# EAGLE design Hfield1A (EAGLE 6.3)
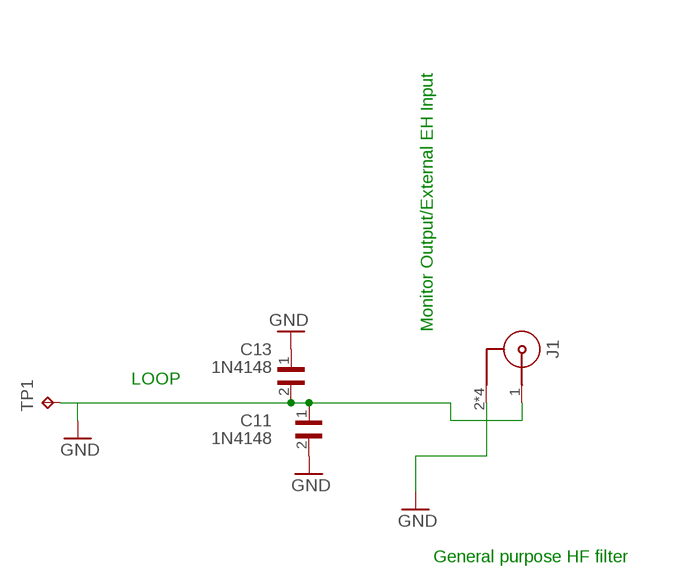
[diagram p0: schematic, sheet 1]

## Parts
C11  1N4148  WCAP-CSGP_0805-REFLOW  [WCAP-CSGP_0805_REFLOW]
C13  1N4148  WCAP-CSGP_0805-REFLOW  [WCAP-CSGP_0805_REFLOW]
J1  60312202114509  [60312202114509]
TP1  TPB2,54  [B2,54]

## Nets
GND: C11.1 C11.2 C13.1 C13.2 J1.1 J1.2 J1.3 J1.4 J1.5 TP1.TP

## Notes on the sheet
- Monitor Output/External EH Input
- LOOP
- General purpose HF filter

## Library data of the parts
C11 C13 = Eagle_Wurth_Elektronik_Passive_Capacitors_rev15a:WCAP-CSGP: WCAP-CSGP Ceramic Capacitors Characteristics Multilayer Ceramic Chip Capacitor Recommended soldering:Reflow, for 0603 and 0805 wave soldering is also allowed Operating temperature:-55 °C to +125 °C; Ceramic characteristics: Class I - NPO ; Class II -X7R, X5R High performance ceramic High capacitance stability Minimal aging Termination:Cu/Ni/Sn <http://katalog.we-online.de/media/images/eisos/WCAP-CSGP_pf2.jpg> Details see: http://katalog.we-online.de/en/pbs/WCAP-CSGP/?m Created: 2015-01-28 2015 (C) Wurth Elektronik
J1 = 60312202111527_Eagle_WR-SMA_rev19a:60312202114509: WR-SMA PCB End Launch Jack Round Post 1.6 mm MATERIAL PROPERTIES Insulator Material PTFE Insulator Color White Center Contact Material Beryllium Copper Center Contact Plating Gold, min. 0.76µm over Nickel Body Material Brass Body Plating Gold, min. 0.076µm over Nickel KIND PROPERTIES Interface MIL-STD-348 Connector Type SMA Gender Jack Orientation Type Straight GENERAL INFORMATION Operating Temperature -65 °C up to +165 °C Compliance RoHS ELECTRICAL PROPERTIES Frequency Range DC~18 GHz MECHANICAL PROPERTIES Mating Cycle 500 Cycles PACKAGING PROPERTIES Packaging Tray <https://katalog.we-online.com/media/images/v2/o122849v209%20WR-SMA_60312202114509.jpg> Details see: https://katalog.we-online.com/en/em/WR-SMA_60312202114509 Updated by Ella Wu 2019-11-07 2019(C) Würth Elektronik; DATASHEET-URL: https://katalog.we-online.com/em/datasheet/60312202114509.pdf; GENDER: Jack; INTERFACE: MIL-STD-348; MOUNT: End Launch; ORIENTATION-TYPE: Straight; PART-NUMBER: 60312202114509; Z: 50Ohm
TP1 = testpad:TP: Test pad

## Board
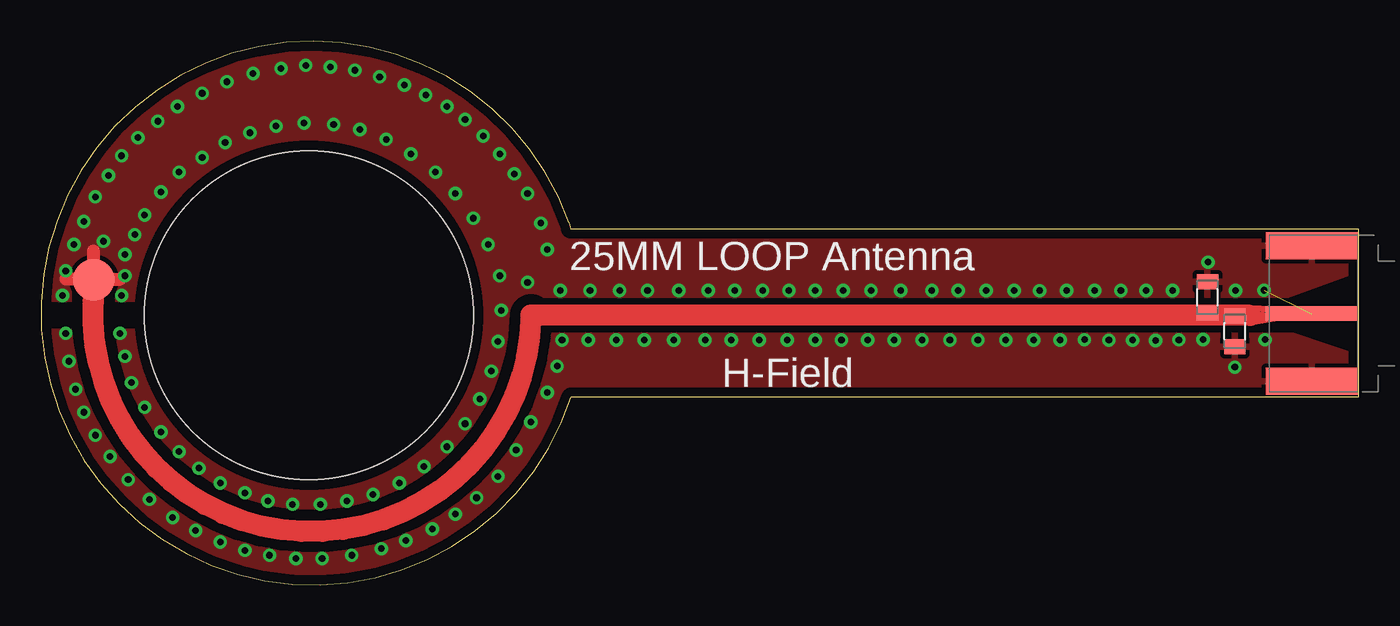
[diagram p1: board, top side]
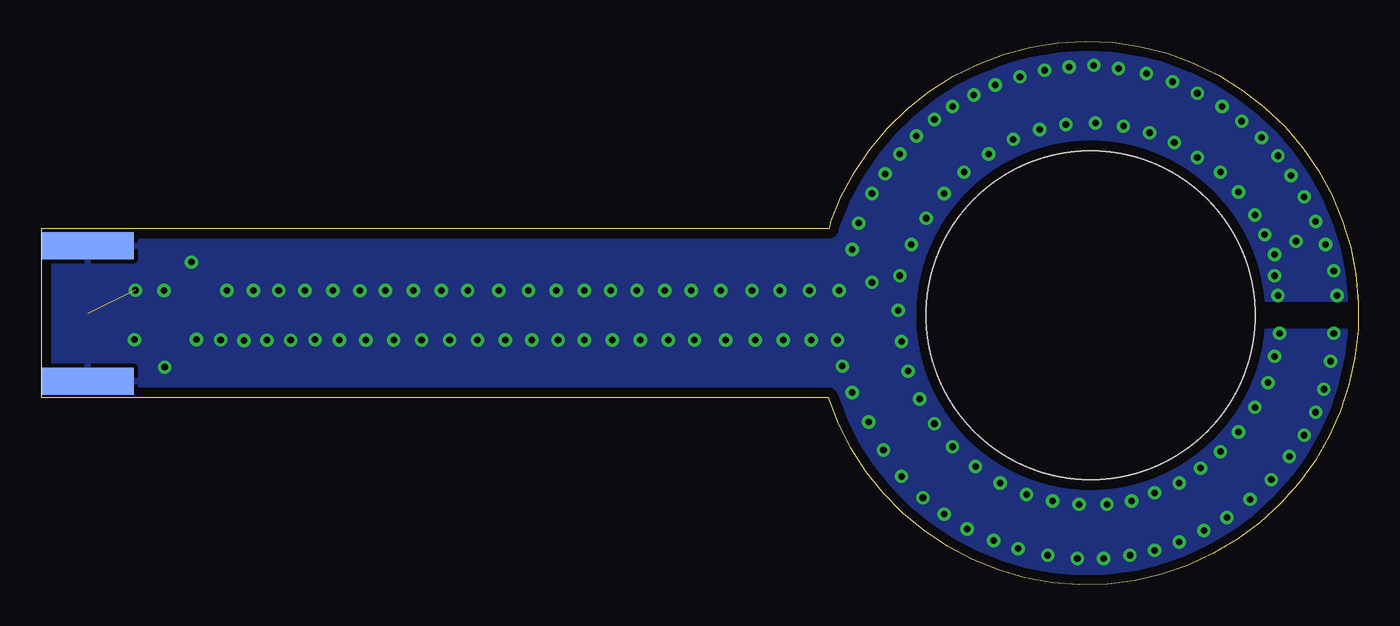
[diagram p2: board, bottom side, seen from below]

Size 80.16 x 33.07 mm. Coordinates in mm from the lower left corner, seen from the top.
Outline: 80.15,11.39 32.24,11.39 arc-322 32.12,22.02 32.23,21.64 80.16,21.64 80.16,11.4
Copper layers (1*16): Top 0.035mm / dielectric 1.5mm / Bottom 0.035mm
Design rules "default *": minimum track width 0.2mm, minimum drill 0.3mm, track to track 0.15mm, track to pad 0.15mm, pad to pad 0.15mm, via to via 0.15mm, smd to smd 0.15mm, copper to edge 0.6mm, drill to drill 8mil, minimum pad ring 10mil, minimum via ring 8mil, stop-mask expansion 4mil, vias tented up to drill 0mil, thermal gap 10mil
Holes 20 mm at 16.3,16.39
tRestrict: 5 lines
bRestrict: 1 lines

### Footprints (pad centres in the part's own frame; a part is rotated, then mirrored left to right if it is on the bottom)
WCAP-CSGP_0805_REFLOW = smd 0.9 x 1.3: 1 -0.95,0; 2 0.95,0
60312202114509 = smd 0.9 x 5.6: 1 0,0 | smd 1.65 x 5.6: 2 -4.125,0; 3 4.125,0 | smd 1.65 x 5.6 bottom: 4 -4.125,0; 5 4.125,0
B2,54 = smd 2.54 x 2.54: TP 0,0

### Placement (x,y rotation side)
C11  70.97,17.48 90 top
C13  72.64,15.42 90 top
J1  77.31,16.5 90 top
TP1  3.21,18.55 0 top

### Tracks (layer width: path | path; a pad name or v marks a point on that pad's centre or on a via)
GND  (via drill 0.4 pad 0.41)  (1 unrouted)
  Top 0.305: C11.1 C13.2 63.55,16.44 63.6,16.39
  Top 0.406: 3.3,18.39 3.21,18.39 TP1.TP 3.21,18.58 3.2,18.59
  Top 0.8: 3.2,18.59 4.8,18.59 | 3.2,18.59 3.2,20.29 | 3.2,18.59 1.5,18.59
  Top 1.27: 73.57,16.39 63.6,16.39 29.8,16.39 arc-92 15.85,3.24 arc-96 3.3,18.39
  other vias: 1.5,15.29 1.7,13.59 2.1,11.89 2.6,10.49 3.3,9.09 4.2,7.79 5.3,6.39 6.6,5.19 8,4.09 9.4,3.29 10.9,2.59 12.4,2.09 13.9,1.79 15.5,1.59 17.1,1.59 18.9,1.79 20.7,2.19 22.2,2.69 23.8,3.39 25.2,4.29 26.5,5.29 4.8,15.29 5.1,13.89 5.5,12.29 6.3,10.79 7.3,9.29 8.4,8.09 9.6,7.09 10.9,6.19 12.4,5.59 13.8,5.09 15.3,4.89 17,4.89 18.6,5.09 20.2,5.49 21.8,6.19 23.3,7.19 24.7,8.39 27.8,6.59 25.8,9.79 28.9,8.19 26.7,11.29 29.8,9.89 27.4,12.99 27.8,14.79 28,16.69 27.9,18.79 30.8,11.69 31.4,13.29 31.7,14.89 4.9,17.59 5.1,18.79 5.1,20.09 3.8,20.89 2,20.69 1.3,17.59 1.5,19.09 29.6,18.39 31.6,17.89 30.8,20.39 27.2,20.69 26.3,22.29 30.4,21.99 25.2,23.79 24,25.09 22.5,26.19 21,27.09 19.4,27.69 17.8,27.99 16,28.09 14.3,27.89 12.7,27.49 11.2,26.89 9.8,25.99 8.4,25.09 7.3,23.89 6.3,22.49 5.7,21.29 2.6,22.09 3.3,23.59 4.1,24.89 4.9,26.09 5.9,27.19 7.1,28.19 8.3,29.09 9.8,29.89 11.3,30.59 12.9,31.09 14.6,31.39 16.1,31.59 17.6,31.49 19.1,31.29 20.6,30.89 22.1,30.39 23.4,29.79 24.7,29.09 25.8,28.29 26.9,27.29 27.9,26.19 28.8,24.99 29.6,23.79 33.3,14.89 35,14.89 36.7,14.89 38.5,14.89 40.4,14.89 42,14.89 43.7,14.89 45.4,14.89 47.1,14.89 42.2,17.89 33.4,17.89 35.2,17.89 36.9,17.89 38.8,17.89 40.6,17.89 43.9,17.89 48.7,14.89 50.3,14.89 51.9,14.89 53.6,14.89 55.3,14.89 57,14.89 58.7,14.89 60.4,14.89 62,14.89 63.49,14.91 64.97,14.88 45.5,17.89 47.1,17.89 48.8,17.89 50.5,17.89 52.3,17.89 54.2,17.89 55.8,17.89 57.5,17.89 59.2,17.89 60.76,17.89 62.4,17.9 64.1,17.89 65.7,17.89 72.68,17.89 74.42,17.91 74.48,14.91 68.86,17.89 67.23,17.9 72.64,13.23 69.23,14.9 70.7,14.91 71.01,19.62 67.81,14.86 66.41,14.88
  pour Top (isolate 0.3): -0.7,36.39 -0.7,-0.61 79.86,-0.47 79.77,36.63
  pour Bottom (isolate 0.3): -0.7,36.39 -0.7,-0.61 80.31,-0.72 79.81,33.78 79.48,36.57
N$1
  Top 0.406: 75.52,16.72 73.6,16.81 73.6,16.5 73.47,16.5 75.33,16.3
N$2
  Top 0.406: 73.6,15.97 75.45,16.27

### Text on the board
tNames: 25MM LOOP Antenna | H-Field
201bmp: C:/Users/sylvain.lebras/Documents/eagle/Logo.bmp
203bmp: C:/Users/sylvain.lebras/Documents/eagle/Logo.bmp